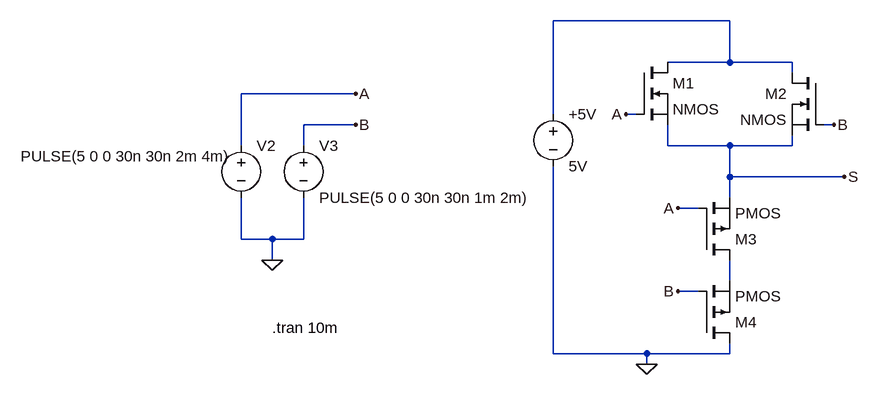
[diagram p0: schematic Porte OR.asc]
Porte OR.asc, the LTspice schematic file:
Version 4
SHEET 1 880 680
WIRE 352 48 80 48
WIRE 352 112 352 48
WIRE 352 112 256 112
WIRE 448 112 352 112
WIRE 448 128 448 112
WIRE -224 160 -400 160
WIRE 80 192 80 48
WIRE 208 192 192 192
WIRE -224 208 -304 208
WIRE 512 208 496 208
WIRE -400 240 -400 160
WIRE -304 240 -304 208
WIRE 256 240 256 208
WIRE 352 240 256 240
WIRE 448 240 448 224
WIRE 448 240 352 240
WIRE 352 288 352 240
WIRE 528 288 352 288
WIRE 352 320 352 288
WIRE 304 336 272 336
WIRE -400 384 -400 320
WIRE -352 384 -400 384
WIRE -304 384 -304 320
WIRE -304 384 -352 384
WIRE -352 416 -352 384
WIRE 352 448 352 416
WIRE 304 464 272 464
WIRE 80 560 80 272
WIRE 224 560 80 560
WIRE 352 560 352 544
WIRE 352 560 224 560
WIRE 224 576 224 560
FLAG -352 416 0
FLAG -224 160 A
FLAG -224 208 B
FLAG 192 192 A
FLAG 512 208 B
FLAG 224 576 0
FLAG 272 336 A
FLAG 272 464 B
FLAG 528 288 S
SYMBOL voltage 80 176 R0
WINDOW 123 0 0 Left 0
WINDOW 39 0 0 Left 0
SYMATTR InstName +5V
SYMATTR Value 5V
SYMBOL voltage -400 224 R0
WINDOW 3 -339 32 Left 2
WINDOW 123 0 0 Left 0
WINDOW 39 0 0 Left 0
SYMATTR Value PULSE(5 0 0 30n 30n 2m 4m)
SYMATTR InstName V2
SYMBOL voltage -304 224 R0
WINDOW 123 0 0 Left 0
WINDOW 39 0 0 Left 0
SYMATTR InstName V3
SYMATTR Value PULSE(5 0 0 30n 30n 1m 2m)
SYMBOL nmos 208 112 R0
SYMATTR InstName M1
SYMBOL nmos 496 128 M0
SYMATTR InstName M2
SYMBOL pmos 304 544 M180
SYMATTR InstName M4
SYMBOL pmos 304 416 M180
SYMATTR InstName M3
TEXT -352 520 Left 2 !.tran 10m

The netlist it stands for:
* Porte OR.asc
V§+5V N001 0 5V
V2 A 0 PULSE(5 0 0 30n 30n 2m 4m)
V3 B 0 PULSE(5 0 0 30n 30n 1m 2m)
M1 N001 A S S NMOS
M2 N001 B S S NMOS
M4 0 B N002 N002 PMOS
M3 N002 A S S PMOS
.model NMOS NMOS
.model PMOS PMOS
.lib standard.mos
.tran 10m
.backanno
.end

* Results of the author's LTspice run, read from the files saved beside the schematic
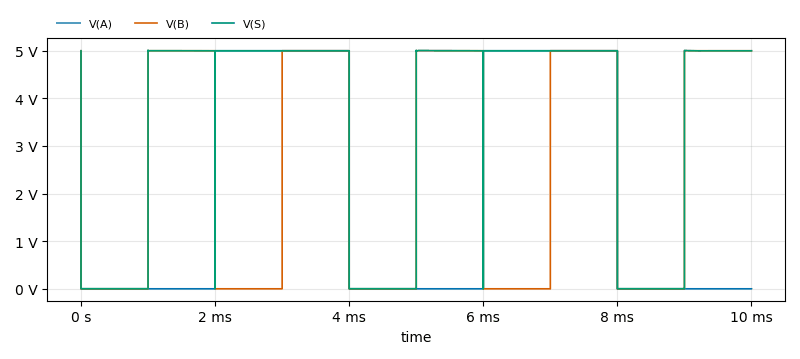
[diagram p1: Transient Analysis of Porte OR.asc, plotted from the saved traces]
* Transient Analysis, 1 run:
*   V(A): min 0 V, max 5 V, average 2 V, rms 3.162 V, last 0 V
*   V(B): min 0 V, max 5 V, average 2.5 V, rms 3.535 V, last 5 V
*   V(S): min 2 mV, max 5.008 V, average 3.5 V, rms 4.183 V, last 4.999 V